# EAGLE design reverb (EAGLE 9.4.2)
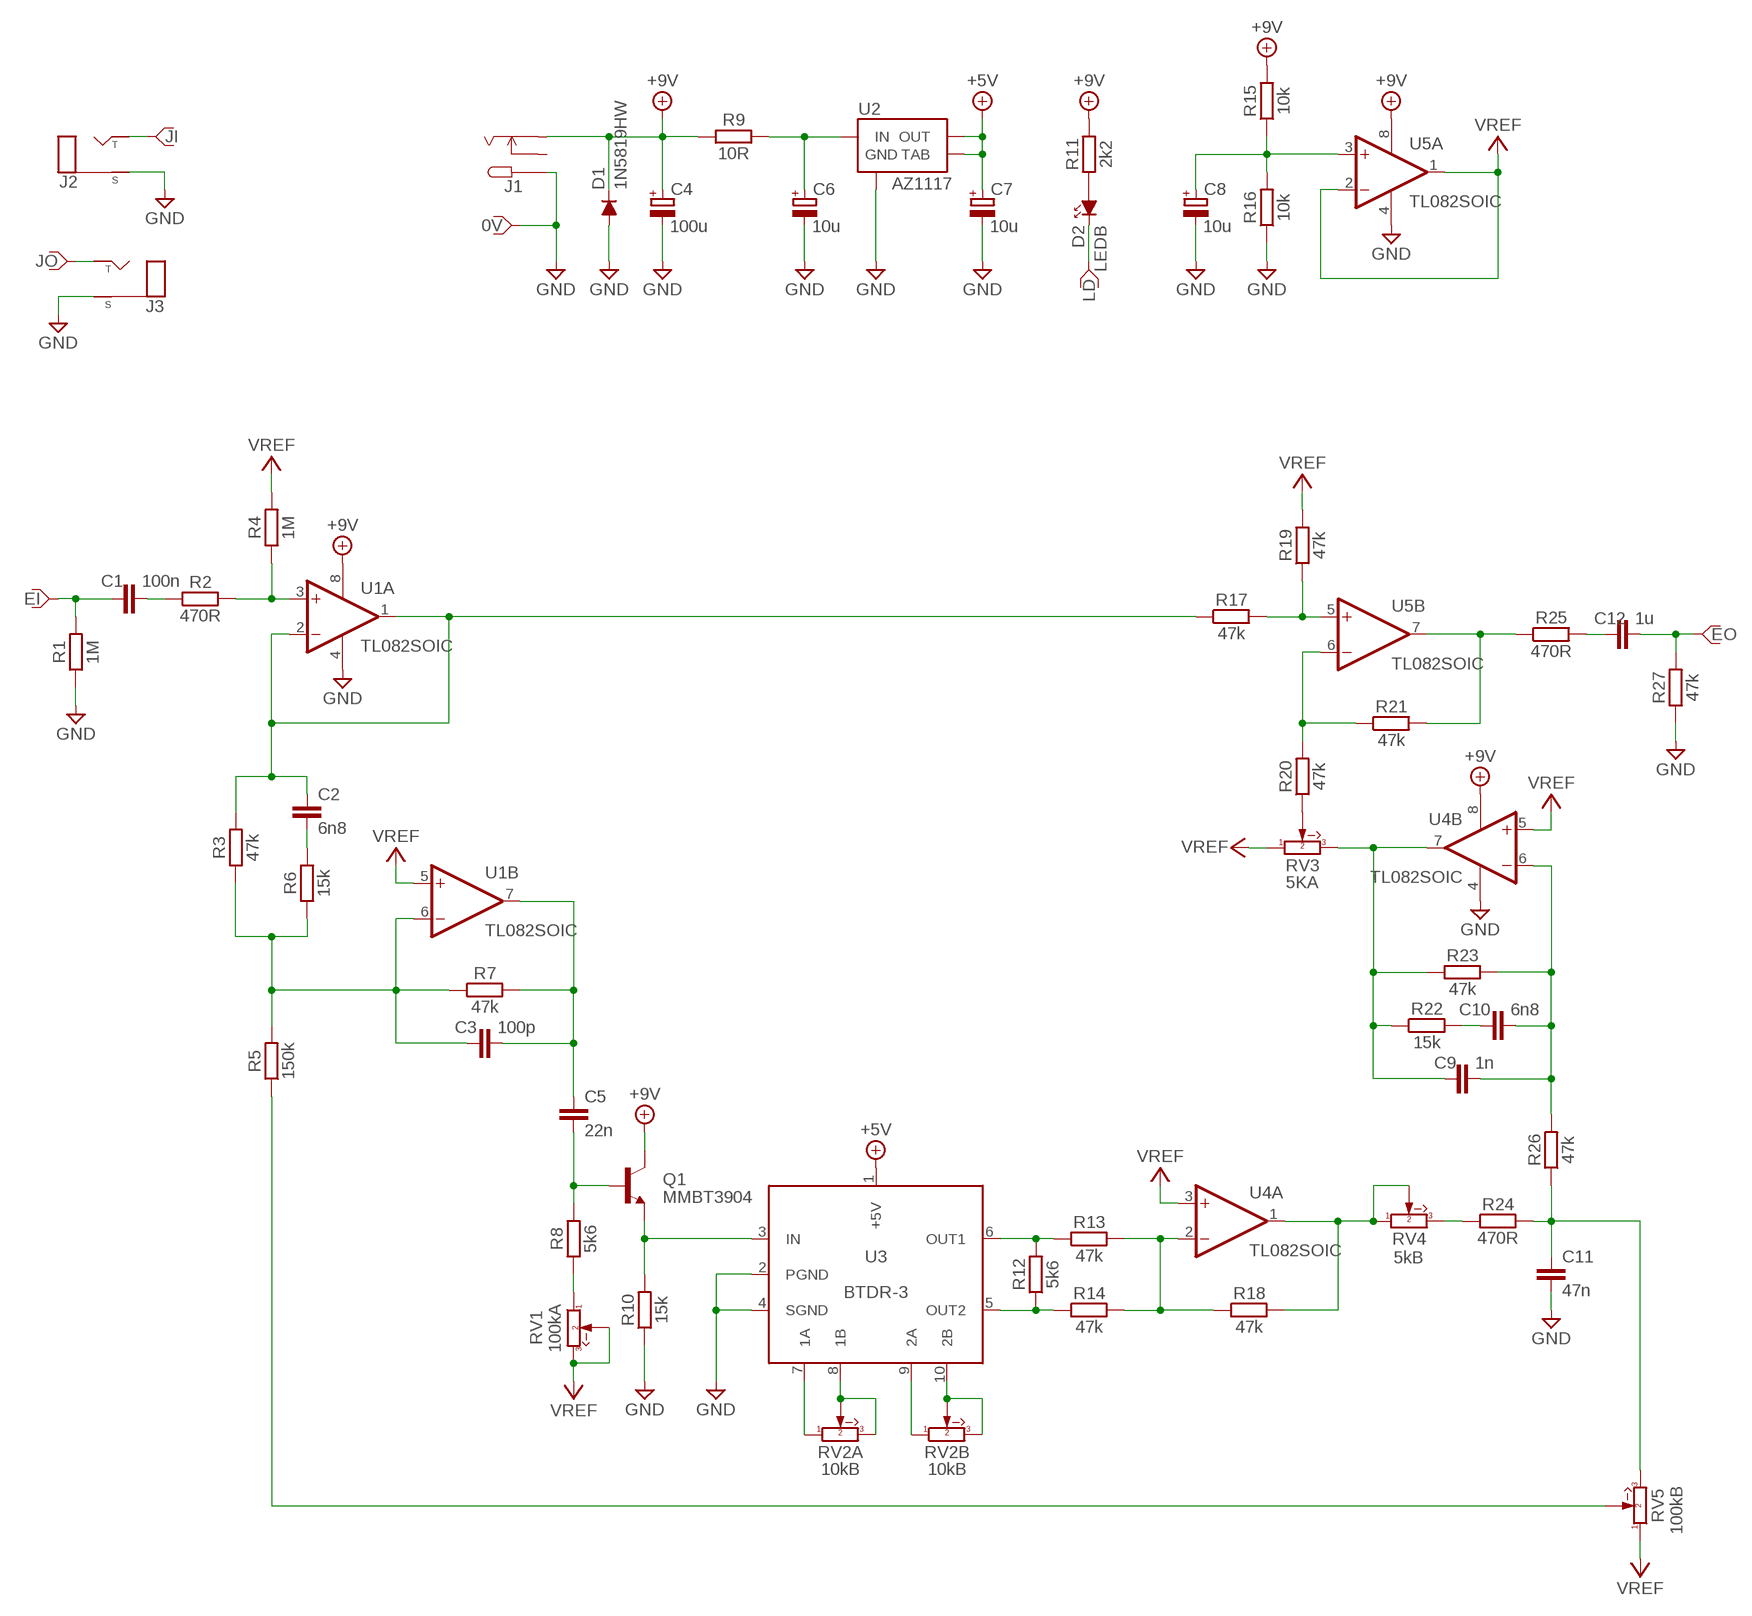
[diagram p0: schematic, sheet 1]

## Parts
C1  100n  CAPACITOR0603  [C_0603]
C2  6n8  CAPACITOR0603  [C_0603]
C3  100p  CAPACITOR0603  [C_0603]
C4  100u  CAPACITOR_POLARISEDTH_5MM  [C_E_TH_5MM]
C5  22n  CAPACITOR0603  [C_0603]
C6  10u  CAPACITOR_POLARISEDTH_5MM  [C_E_TH_5MM]
C7  10u  CAPACITOR_POLARISEDTH_5MM  [C_E_TH_5MM]
C8  10u  CAPACITOR_POLARISEDTH_5MM  [C_E_TH_5MM]
C9  1n  CAPACITOR0603  [C_0603]
C10  6n8  CAPACITOR0603  [C_0603]
C11  47n  CAPACITOR0603  [C_0603]
C12  1u  CAPACITOR0603  [C_0603]
D1  1N5819HW  [SOD123]
D2  LEDB  [LED_5MM]
J1  DC_JACK_C2  [DC_JACK_CON_2MM]
J2  MONOJACK2MM  [MONOJACK_CON_2MM]
J3  MONOJACK2MM  [MONOJACK_CON_2MM]
P1  0V  CON_PIN  [CON_PIN]
P2  LD  CON_PIN  [CON_PIN]
P3  JO  CON_PIN  [CON_PIN]
P4  JI  CON_PIN  [CON_PIN]
P5  EO  CON_PIN  [CON_PIN]
P6  EI  CON_PIN  [CON_PIN]
Q1  MMBT3904  [SOT23]
R1  1M  RESISTOR0603  [R_0603]
R2  470R  RESISTOR0603  [R_0603]
R3  47k  RESISTOR0603  [R_0603]
R4  1M  RESISTOR0603  [R_0603]
R5  150k  RESISTOR0603  [R_0603]
R6  15k  RESISTOR0603  [R_0603]
R7  47k  RESISTOR0603  [R_0603]
R8  5k6  RESISTOR0603  [R_0603]
R9  10R  RESISTOR0603  [R_0603]
R10  15k  RESISTOR0603  [R_0603]
R11  2k2  RESISTOR0603  [R_0603]
R12  5k6  RESISTOR0603  [R_0603]
R13  47k  RESISTOR0603  [R_0603]
R14  47k  RESISTOR0603  [R_0603]
R15  10k  RESISTOR0603  [R_0603]
R16  10k  RESISTOR0603  [R_0603]
R17  47k  RESISTOR0603  [R_0603]
R18  47k  RESISTOR0603  [R_0603]
R19  47k  RESISTOR0603  [R_0603]
R20  47k  RESISTOR0603  [R_0603]
R21  47k  RESISTOR0603  [R_0603]
R22  15k  RESISTOR0603  [R_0603]
R23  47k  RESISTOR0603  [R_0603]
R24  470R  RESISTOR0603  [R_0603]
R25  470R  RESISTOR0603  [R_0603]
R26  47k  RESISTOR0603  [R_0603]
R27  47k  RESISTOR0603  [R_0603]
RV1  100kA  POTENTIOMETERA  [R_V_ALPHA_PCB_16MM]
RV2  10kB  POTENTIOMETER_DUALA  [R_V_ALPHA_PCB_16MM_DUAL]
RV3  5KA  POTENTIOMETERA  [R_V_ALPHA_PCB_16MM]
RV4  5kB  POTENTIOMETERA  [R_V_ALPHA_PCB_16MM]
RV5  100kB  POTENTIOMETERA  [R_V_ALPHA_PCB_16MM]
U1  TL082SOIC  [SOIC8]
U2  AZ1117  [SOT223]
U3  BTDR-3  [BTDR-3]
U4  TL082SOIC  [SOIC8]
U5  TL082SOIC  [SOIC8]

## Nets
+5V: C7.+VE(+) U2.2(OUT) U2.4(TAB) U3.1(+5V)
+9V: C4.+VE(+) D1.C J1.S Q1.3(C) R9.2 R11.2 R15.2 U1.8(P:V+) U4.8(P:V+) U5.8(P:V+)
GND: C4.-VE(-) C6.-VE(-) C7.-VE(-) C8.-VE(-) C11.1 D1.A J1.T J2.S J3.S P1.1 R1.1 R10.1 R16.1 R27.1 U1.4(P:V-) U2.1(GND) U3.2(PGND) U3.4(SGND) U4.4(P:V-) U5.4(P:V-)
N$1: C11.2 R24.2 R26.1 RV5.3
N$2: C8.+VE(+) R15.1 R16.2 U5.3(A:+IN)
N$3: C1.1 R2.1
N$4: R2.2 R4.1 U1.3(A:+IN)
N$5: C1.2 P6.1 R1.2
N$6: R17.2 R19.1 U5.5(B:+IN)
N$7: R20.2 R21.1 U5.6(B:-IN)
N$8: R21.2 R25.1 U5.7(B:OUT)
N$9: C12.2 R25.2
N$10: C12.1 P5.1 R27.2
N$11: C3.1 C5.2 R7.2 U1.7(B:OUT)
N$12: R24.1 RV4.3
N$13: C2.1 R6.2
N$14: C5.1 Q1.1(B) R8.2
N$15: Q1.2(E) R10.2 U3.3(IN)
N$16: RV2.A1 U3.7(1A)
N$17: RV2.A2 RV2.A3 U3.8(1B)
N$18: RV2.B1 U3.9(2A)
N$19: RV2.B2 RV2.B3 U3.10(2B)
N$20: R12.2 R13.1 U3.6(OUT1)
N$21: R12.1 R14.1 U3.5(OUT2)
N$22: R13.2 R14.2 R18.1 U4.2(A:-IN)
N$23: R18.2 RV4.1 RV4.2 U4.1(A:OUT)
N$24: C6.+VE(+) R9.1 U2.3(IN)
N$25: C2.2 R3.2 R17.1 U1.1(A:OUT) U1.2(A:-IN)
N$26: C9.2 R22.1 R23.1 RV3.3 U4.7(B:OUT)
N$27: R8.1 RV1.1
N$28: C9.1 C10.1 R23.2 R26.2 U4.6(B:-IN)
N$29: C10.2 R22.2
N$30: R20.1 RV3.2
N$31: R5.1 RV5.2
N$32: J3.T P3.1
N$33: D2.A R11.1
N$34: J2.T P4.1
N$35: C3.2 R3.1 R5.2 R6.1 R7.1 U1.6(B:-IN)
N$36: D2.C P2.1
VREF: R4.2 R19.2 RV1.2 RV1.3 RV3.1 RV5.1 U1.5(B:+IN) U4.3(A:+IN) U4.5(B:+IN) U5.1(A:OUT) U5.2(A:-IN)
Unconnected: J1.SW

## Library data of the parts
C1-C3 C5 C9-C12 = a_passive:CAPACITOR
C4 C6-C8 = a_passive:CAPACITOR_POLARISED: Polarised electrolytic capacitors Nichicon WT series
D1 = a_diode:1N5819HW
D2 = a_diode:LED
J1 = a_misc:DC_JACK
J2 J3 = a_misc:MONOJACK
P1-P6 = a_misc:CON_PIN
Q1 = a_transistor:MMBT3904: NPN TRANSISTOR
R1-R27 = a_passive:RESISTOR
RV1 RV3-RV5 = a_passive:POTENTIOMETER
RV2 = a_passive:POTENTIOMETER_DUAL
U1 U4 U5 = a_ic:TL082: OP AMP Data sheet <http://www.ti.com/lit/ds/symlink/tl084a . pdf>; DATA_SHEET: <a href="http://www.ti.com/lit/ds/symlink/tl084a.pdf"> Data sheet </a>
U2 = a_ic:AZ1117
U3 = a_ic:BTDR-3

## Board
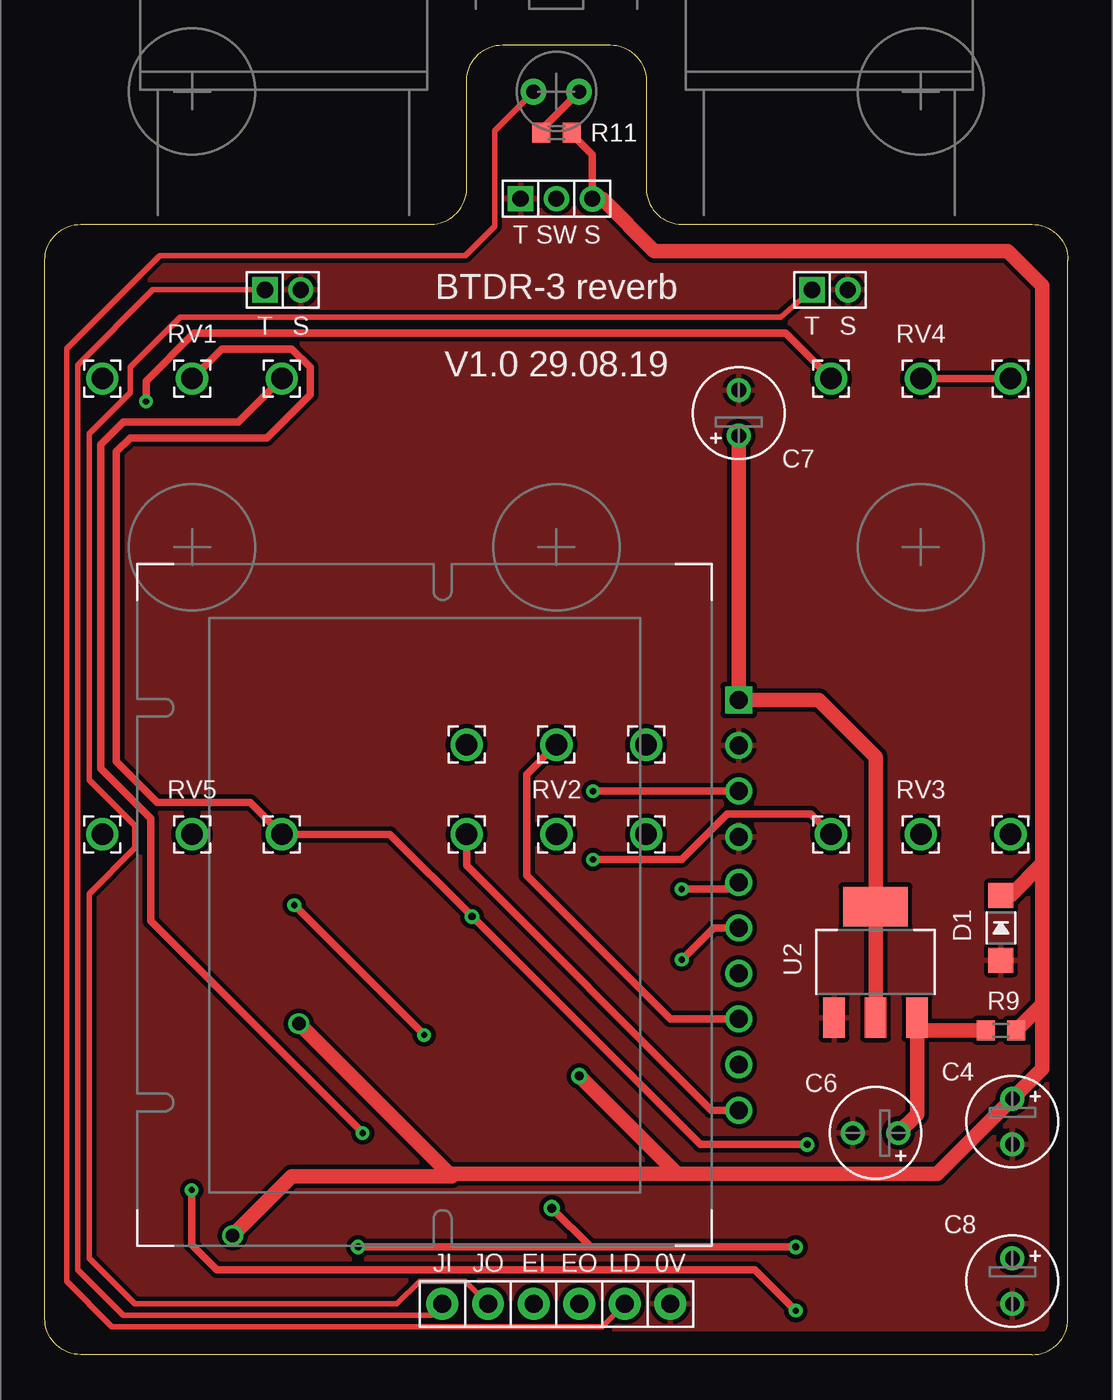
[diagram p1: board, top side]
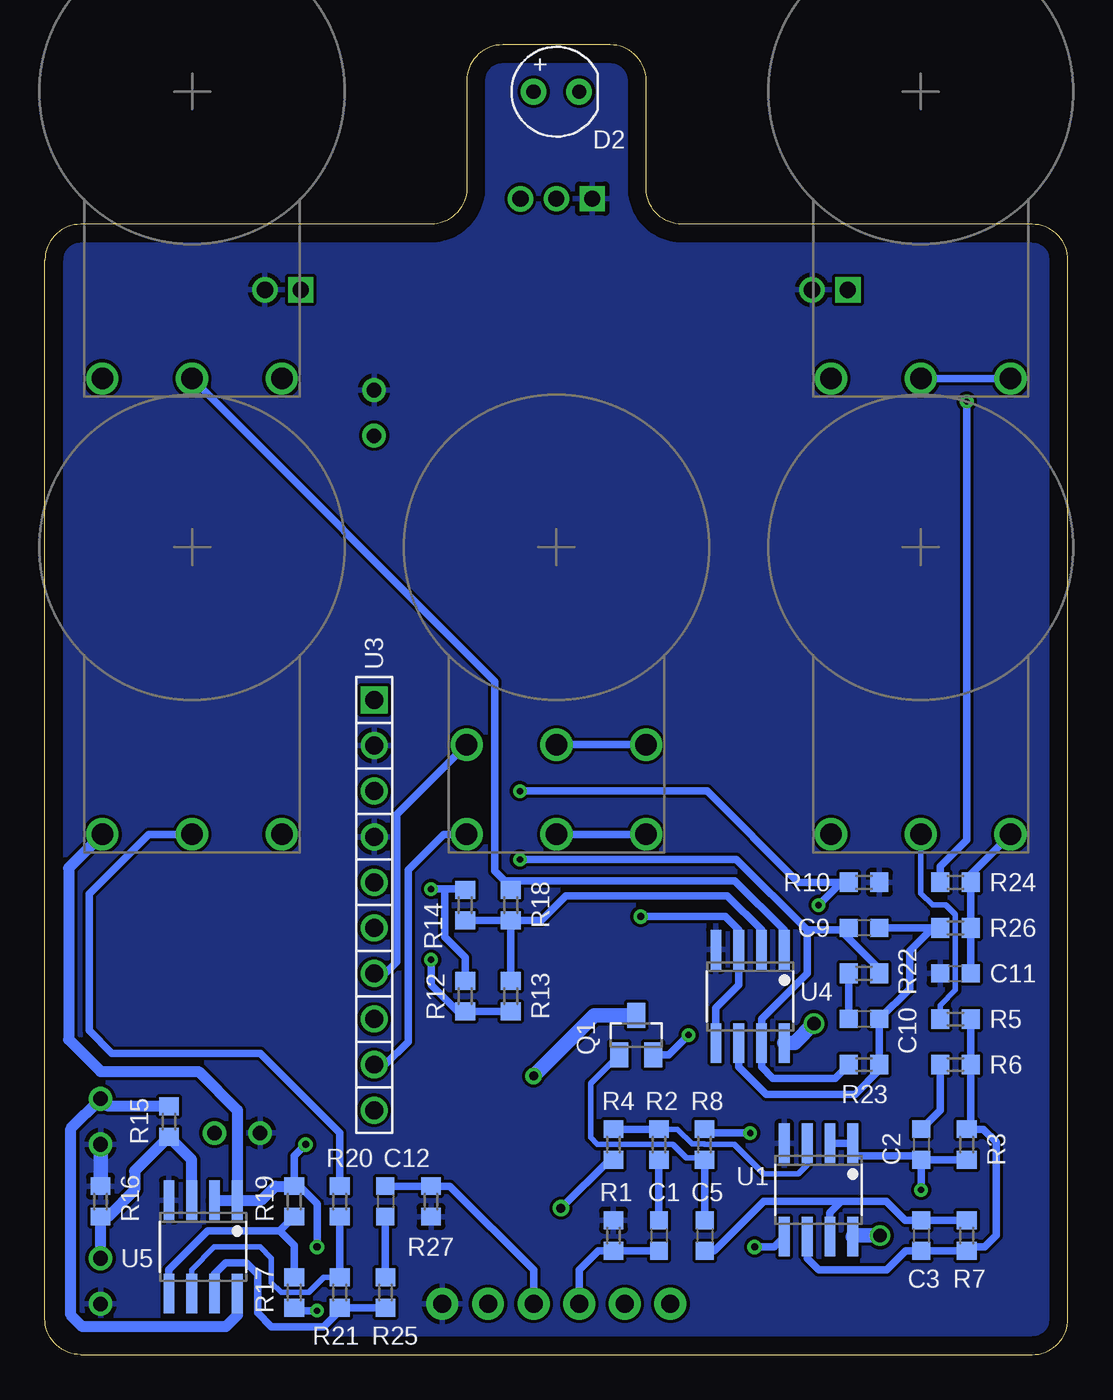
[diagram p2: board, bottom side, seen from below]

Size 57 x 73 mm. Coordinates in mm from the lower left corner, seen from the top.
Outline: 0,2 0,61 arc-90 2,63 21.5,63 arc90 23.5,65 23.5,71 arc-90 25.5,73 31.5,73 arc-90 33.5,71 33.5,65 arc90 35.5,63 55,63 arc-90 57,61 57,2 arc-90 55,0 2,0 arc-90 0,2
Copper layers (1*16): Top 0.035mm / dielectric 1.5mm / Bottom 0.035mm
Design rules "default *": minimum track width 6mil, minimum drill 0.35mm, track to track 7mil, track to pad 7mil, pad to pad 7mil, via to via 7mil, smd to smd 7mil, copper to edge 40mil, drill to drill 7mil, minimum pad ring 10mil, minimum via ring 8mil, stop-mask expansion 4mil, vias tented up to drill 0mil, thermal gap 10mil

### Footprints (pad centres in the part's own frame; a part is rotated, then mirrored left to right if it is on the bottom)
C_0603 = smd 1 x 1: 1 -0.85,0; 2 0.85,0
C_E_TH_5MM = drill 0.813: +VE -1.27,0; -VE 1.27,0
SOD123 = smd 1.4 x 1.4: A 1.805,0; C -1.805,0
LED_5MM = drill 0.8 pad 1.422: A -1.27,0; C 1.27,0
DC_JACK_CON_2MM = drill 0.9 pad 1.422: S 2,0 | drill 0.9: SW 0,0 | drill 0.9 square: T -2,0
MONOJACK_CON_2MM = drill 0.9: S 1,0 | drill 0.9 square: T -1,0
CON_PIN = drill 1 pad 1.778: 1 0,0
SOT23 = smd 1 x 1.4: 1 -0.95,-1.1; 2 0.95,-1.1; 3 0,1.1
R_0603 = smd 1 x 1.1: 1 -0.85,0; 2 0.85,0
R_V_ALPHA_PCB_16MM = drill 1.2: 1 -5,-16; 2 0,-16; 3 5,-16
R_V_ALPHA_PCB_16MM_DUAL = drill 1.2: A1 -5,-11; A2 0,-11; A3 5,-11; B1 -5,-16; B2 0,-16; B3 5,-16
SOIC8 = smd 0.6 x 2.2: 1 -1.905,-2.6; 2 -0.635,-2.6; 3 0.635,-2.6; 4 1.905,-2.6; 5 1.905,2.6; 6 0.635,2.6; 7 -0.635,2.6; 8 -1.905,2.6
SOT223 = smd 1.219 x 2.235: 1 -2.311,-3.099; 2 0,-3.099; 3 2.311,-3.099 | smd 3.6 x 2.2: 4 0,3.099
BTDR-3 = drill 1 square: 1 11.43,0 | drill 1: 2 8.89,0; 3 6.35,0; 4 3.81,0; 5 1.27,0; 6 -1.27,0; 7 -3.81,0; 8 -6.35,0; 9 -8.89,0; 10 -11.43,0

### Placement (x,y rotation side)
C1  22.79,6.64 270 bottom
C2  8.18,11.72 270 bottom
C3  8.18,6.64 270 bottom
C4  53.9,12.99 270 top
C5  20.24,6.64 270 bottom
C6  46.28,12.36 180 top
C7  38.66,52.49 90 top
C8  53.9,4.1 270 top
C9  11.36,23.78 180 bottom
C10  11.36,18.7 180 bottom
C11  6.27,21.25 0 bottom
C12  38.02,8.55 270 bottom
D1  53.27,23.78 270 top
D2  28.5,70.39 0 bottom
J1  28.5,64.42 0 top
J2  13.26,59.34 0 top
J3  43.74,59.34 0 top
P1  34.85,2.83 0 top
P2  32.31,2.83 0 top
P3  24.69,2.83 0 top
P4  22.15,2.83 0 top
P5  29.77,2.83 0 top
P6  27.23,2.83 0 top
Q1  24.05,17.82 0 bottom
R1  25.32,6.64 270 bottom
R2  22.79,11.72 90 bottom
R3  5.64,11.72 270 bottom
R4  25.32,11.72 270 bottom
R5  6.27,18.7 0 bottom
R6  6.27,16.17 180 bottom
R7  5.64,6.64 90 bottom
R8  20.24,11.72 270 bottom
R9  53.27,18.07 0 top
R10  11.36,26.33 180 bottom
R11  28.5,68.11 0 top
R12  33.58,19.97 270 bottom
R13  31.04,19.97 90 bottom
R14  33.58,25.06 270 bottom
R15  50.09,12.99 90 bottom
R16  53.9,8.55 270 bottom
R17  43.11,3.47 90 bottom
R18  31.04,25.06 90 bottom
R19  43.11,8.55 90 bottom
R20  40.56,8.55 270 bottom
R21  40.56,3.47 270 bottom
R22  11.36,21.25 180 bottom
R23  11.36,16.17 0 bottom
R24  6.27,26.33 0 bottom
R25  38.02,3.47 90 bottom
R26  6.27,23.78 180 bottom
R27  35.48,8.55 90 bottom
RV1  8.2,70.4 0 bottom
RV2  28.5,45 0 bottom
RV3  48.8,45 0 bottom
RV4  48.8,70.4 0 bottom
RV5  8.2,45 0 bottom
U1  13.89,9.18 180 bottom
U2  46.28,21.88 0 top
U3  38.66,25.06 90 top
U4  17.7,19.97 180 bottom
U5  48.19,6 180 bottom

### Tracks (layer width: path | path; a pad name or v marks a point on that pad's centre or on a via)
+5V
  Top 0.813: U2.2 U2.4 46.28,33.31 43.11,36.48 U3.1 C7.+VE
+9V  (via drill 0.5, 0.75)
  Top 0.406: J1.S 30.5,66.87 29.35,68.02 R11.2
  Top 0.813: J1.S 31.04,64.42 33.96,61.5 53.65,61.5 55.58,59.57 55.58,27.37 | D1.C 53.8,25.59 55.58,27.37 | 55.58,19.53 55.58,15.94 C4.+VE 49.71,10.07 35.23,10.07 | 55.58,19.53 55.58,27.37 | R9.2 55.58,19.53 | v10.47,6.64 13.77,9.94 22.66,9.94 22.53,10.07 | 22.53,10.07 35.23,10.07 | v14.15,18.45 22.53,10.07 | v29.77,15.53 35.23,10.07
  Bottom 0.61: U5.8 46.28,2.19 46.91,1.56 54.92,1.56 55.55,2.2 55.55,12.61 C4.+VE 53.48,13.84 R15.2
  Bottom 0.813: v14.15,18.45 15.22,17.38 U4.8 | v10.47,6.64 11.93,6.64 U1.8 | Q1.3 26.38,18.92 v29.77,15.53
GND
  Bottom 0.813: R16.1 C4.-VE
  pour Top (isolate 0.254): 1.2,56.17 6.27,61.25 23.29,61.25 24.94,62.9 24.94,65.19 30.79,65.19 34.47,61.5 53.65,61.5 55.93,59.22 55.93,1.43 3.86,1.43 1.2,4.1
  pour Bottom: 55,0 2,0 arc-90 0,2 0,61 arc-90 2,63 21.5,63 arc90 23.5,65 23.5,71 arc-90 25.5,73 31.5,73 arc-90 33.5,71 33.5,65 arc90 35.5,63 55,63 arc-90 57,61 57,2 arc-90
N$1
  Bottom 0.406: C11.2 R26.1 R24.2 5.43,26.78 RV5.3
N$2
  Bottom 0.61: U5.3 48.82,10.87 R15.1 52,10.23 52,9.18 53.48,7.69 R16.2 C8.+VE
N$3
  Bottom 0.406: C1.1 R2.1
N$4
  Bottom 0.305: U1.3 14.53,10.58 15.04,10.07 16.94,10.07 18.59,11.72 20.24,11.72 20.27,11.74 20.93,11.74 21.76,12.57 R2.2
  Bottom 0.406: R4.1 R2.2
N$5
  Bottom 0.406: P6.1 27.23,4.73 26.18,5.79 R1.2 C1.2
N$6
  Bottom 0.406: U5.5 50.09,4.73 47.93,6.89 43.91,6.89 | 43.91,6.89 R19.1 | R17.2 43.11,6.09 43.91,6.89
N$7
  Bottom 0.305: U5.6 48.82,4.73 47.55,6 45.01,6 44.38,5.37 44.38,4 43.84,3.47 42.3,3.47 41.45,4.31 R21.1
  Bottom 0.406: R21.1 R20.2
N$8
  Bottom 0.406: U5.7 47.55,4.48 46.91,5.12 45.77,5.12 45.14,4.48 45.14,2.32 44.38,1.56 41.45,1.56 40.56,2.45 R21.2 R25.1
N$9
  Bottom 0.406: R25.2 C12.2
N$10
  Bottom 0.406: C12.1 R27.2 34.43,9.39 29.77,4.73 P5.1
N$11
  Bottom 0.406: R7.2 C3.1 9.07,7.49 10.12,8.55 12.62,8.55 | U1.7 13.26,7.91 12.62,8.55 | C5.2 19.7,5.79 16.94,8.55 12.62,8.55
N$12  (via drill 0.35)
  Top 0.406: v5.64,53.12 5.64,54.27 8.31,56.93 41.27,56.93 RV4.3
  Bottom 0.406: R24.1 7.12,27.21 5.64,28.7 v5.64,53.12
N$13
  Bottom 0.406: C2.1 7.12,13.62 R6.2
N$14
  Bottom 0.305: R8.2 20.33,10.96 21.26,10.96 22.02,11.72 26.21,11.72 26.59,12.1 26.59,15.13 Q1.1
  Bottom 0.406: C5.1 R8.2
N$15  (via drill 0.35)
  Top 0.406: U3.3 v30.53,31.41 | v13.89,25.06 v21.13,17.82
  Bottom 0.406: v30.53,31.41 20.09,31.41 15.02,26.33 12.62,26.33 | R10.2 12.62,26.33 | v13.89,25.06 12.62,26.33 | v21.13,17.82 22.23,16.72 Q1.2
N$16
  Bottom 0.406: RV2.A1 37.39,30.11 37.39,21.88 38.02,21.25 U3.7
N$17
  Top 0.406: U3.8 34.85,18.7 26.85,26.71 26.85,32.35 RV2.A2
  Bottom 0.406: RV2.A3 RV2.A2
N$18
  Bottom 0.406: RV2.B1 34.77,29 36.76,27.02 36.76,17.44 38.02,16.17 U3.9
N$19
  Top 0.406: U3.10 37.14,13.62 23.5,27.26 RV2.B3
  Bottom 0.406: RV2.B3 RV2.B2
N$20  (via drill 0.35)
  Top 0.406: U3.6 37.26,23.78 v35.48,22.01
  Bottom 0.406: v35.48,22.01 35.48,20.61 34,19.12 R12.2 R13.1
N$21  (via drill 0.35)
  Top 0.406: U3.5 38.28,25.94 v35.48,25.94
  Bottom 0.406: R12.1 33.58,22.13 34.72,23.28 34.72,25.82 34.6,25.94 | R14.1 33.62,25.94 34.6,25.94 | v35.48,25.94 34.6,25.94
N$22
  Bottom 0.406: R13.2 R18.1 | R14.2 R18.1 | U4.2 17.07,23.66 18.99,25.58 27.98,25.58 29.35,24.2 R18.1
N$23
  Top 0.406: RV4.2 RV4.1
  Bottom 0.406: U4.1 15.8,23.66 18.55,26.41 31.04,26.41 | RV4.2 31.93,37.53 31.93,26.96 31.38,26.41 31.04,26.41 | R18.2 31.04,26.41
N$24
  Top 0.813: C6.+VE 48.59,13.4 48.59,18.07 | U2.3 48.59,18.07 | R9.1 48.59,18.07
N$25  (via drill 0.35)
  Top 0.406: v41.84,2.45 39.55,4.73 9.58,4.73 8.18,6.13 v8.18,9.18
  Bottom 0.406: U1.2 U1.1 11.99,11.08 8.39,11.08 C2.2 | R3.2 C2.2 | R17.1 42.94,2.45 v41.84,2.45 | v8.18,9.18 C2.2
N$26  (via drill 0.35)
  Top 0.406: RV3.3 42.66,30.13 38.02,30.13 35.48,27.59 v30.53,27.59
  Bottom 0.406: 14.53,23.66 18.47,27.59 v30.53,27.59 | 14.53,23.66 14.53,21.25 17.07,18.7 U4.7 17.07,16.04 16.44,15.4 12.97,15.4 R23.1 | 14.53,23.66 12.67,23.66 | 12.67,23.66 12.29,23.66 12.29,23.7 C9.2 | R22.1 10.5,21.49 12.67,23.66
N$27  (via drill 0.35)
  Top 0.406: v17.7,12.36 5.89,24.17 5.89,29.88 3.1,32.67 3.1,50.71 4.37,51.98 10.78,51.98 RV1.1
  Bottom 0.406: R8.1 20.03,12.36 v17.7,12.36
N$28
  Bottom 0.406: R26.2 7.55,23.78 | 7.55,23.78 C9.1 | 7.55,23.78 8.82,22.52 8.82,20.39 C10.1 R23.2 10.5,15.87 11.86,14.51 16.82,14.51 18.34,16.04 U4.6
N$29
  Bottom 0.406: C10.2 R22.2
N$30
  Bottom 0.406: R20.1 40.56,12.36 45.01,16.8 53.27,16.8 54.53,18.07 54.53,25.69 51.23,29 RV3.2
N$31
  Bottom 0.305: R5.1 7.12,19.47 6.27,20.32 6.27,24.53 6.8,25.06 7.55,25.06 8.2,25.71 RV5.2
N$32
  Top 0.305: J3.T 41,57.82 7.55,57.82 4.75,55.03 4.75,53.63 2.46,51.34 2.46,32.04 5,29.5 5,28.23 2.46,25.69 2.46,5.37 5,2.83 19.61,2.83 20.88,4.1 23.42,4.1 P3.1
N$33
  Top 0.406: D2.A 27.65,68.27 R11.1
N$34
  Top 0.305: J2.T 6.02,59.34 1.83,55.15 1.83,4.73 4.37,2.19 21.52,2.19 P4.1
N$35
  Bottom 0.406: U1.6 14.53,5.37 13.89,4.73 10.09,4.73 9.03,5.79 C3.2 R7.1 5.43,6 4.62,6 3.99,6.64 3.99,11.85 4.71,12.57 R3.1 5.43,12.78 R6.1 R5.2
N$36
  Top 0.305: P2.1 31.04,1.56 3.73,1.56 1.22,4.08 1.22,56.07 6.4,61.25 23.42,61.25 25.07,62.9 25.07,68.23 D2.C
VREF  (via drill 0.4, 0.5)
  Top 0.406: RV1.2 9.84,56.04 13.77,56.04 14.78,55.03 14.78,53.5 12.37,51.09 4.75,51.09 3.99,50.33 3.99,33.06 6.27,30.77 11.43,30.77 RV5.1 19.22,29 v23.8,24.42 36.5,11.72 v42.47,11.72 | v17.45,6 30.41,6 | 30.41,6 v41.84,6 | 30.41,6 v28.25,8.16
  Bottom 0.406: RV1.3 RV1.2 | v41.84,6 41.84,8.42 42.81,9.39 R19.2 43.11,11.08 v42.47,11.72 | U4.5 19.61,19.34 18.34,20.61 U4.3 18.34,23.66 19.1,24.42 v23.8,24.42 | U1.5 16.38,6 v17.45,6 | R4.2 25.54,10.87 v28.25,8.16
  Bottom 0.61: U5.2 U5.1 | U5.1 46.28,13.62 48.44,15.78 53.9,15.78 55.68,17.56 55.68,27.12 RV3.1 | U5.1 44.95,8.61 44.16,9.39 R19.2

### Text on the board
tPlace: BTDR-3 reverb | V1.0 29.08.19